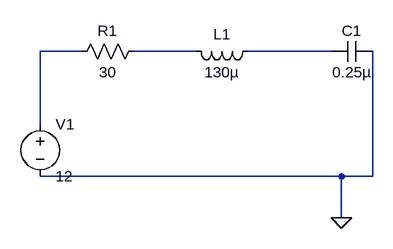
[diagram p0: schematic rlc circuit.asc]
rlc circuit.asc, the LTspice schematic file:
Version 4.1
SHEET 1 880 680
WIRE 96 48 32 48
WIRE 272 48 176 48
WIRE 480 48 352 48
WIRE 32 160 32 48
WIRE 496 240 32 240
WIRE 544 240 544 48
WIRE 544 240 496 240
WIRE 496 304 496 240
FLAG 496 304 0
SYMBOL voltage 32 144 R0
WINDOW 123 0 0 Left 0
WINDOW 39 0 0 Left 0
SYMATTR InstName V1
SYMATTR Value 12
SYMBOL res 192 32 R90
WINDOW 0 0 56 VBottom 2
WINDOW 3 32 56 VTop 2
SYMATTR InstName R1
SYMATTR Value 30
SYMBOL ind 368 32 R90
WINDOW 0 5 56 VBottom 2
WINDOW 3 32 56 VTop 2
SYMATTR InstName L1
SYMATTR Value 130µ
SYMBOL cap 544 32 R90
WINDOW 0 0 32 VBottom 2
WINDOW 3 32 32 VTop 2
SYMATTR InstName C1
SYMATTR Value 0.25µ

The netlist it stands for:
* rlc circuit.asc
V1 N001 0 12
R1 N002 N001 30
L1 N003 N002 130µ
C1 0 N003 0.25µ
.backanno
.end